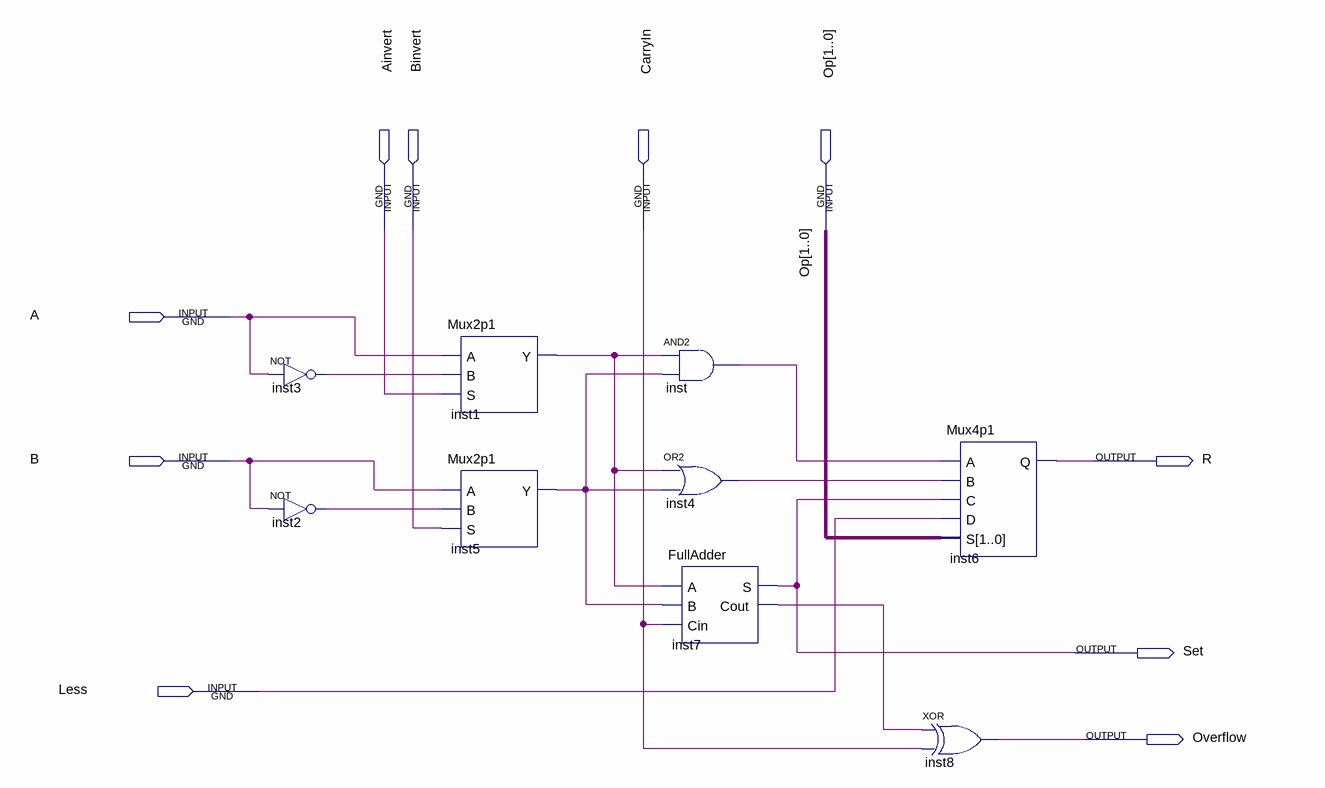
[diagram p0: schematic sheet]
// Quartus schematic Ultima_ULA.bdf as structural Verilog: 9 symbols, 10 pins
module Ultima_ULA (
  input  Ainvert,
  input  Binvert,
  input  CarryIn,
  input  [1:0] Op,
  input  A,
  input  B,
  input  Less,
  output R,
  output Set,
  output Overflow
);

  wire inst1_y, inst2_out, inst3_out, inst4_out, inst5_y, inst7_cout, inst_out;

  not inst3 (inst3_out, A);
  not inst2 (inst2_out, B);
  Mux2p1 inst1 (.A(A), .B(inst3_out), .S(Ainvert), .Y(inst1_y));
  Mux2p1 inst5 (.A(B), .B(inst2_out), .S(Binvert), .Y(inst5_y));
  and inst (inst_out, inst1_y, inst5_y);
  or inst4 (inst4_out, inst1_y, inst5_y);
  FullAdder inst7 (.A(inst1_y), .B(inst5_y), .Cin(CarryIn), .S(Set), .Cout(inst7_cout));
  Mux4p1 inst6 (.A(inst_out), .B(inst4_out), .C(Set), .D(Less), .S(Op), .Q(R));
  xor inst8 (Overflow, inst7_cout, CarryIn);
endmodule
